# EAGLE design working (EAGLE 9.5.1)
COMPANY: ADAFRUIT INDUSTRIES; DRAWN: LADYADA; REV: D; YEAR: 2020
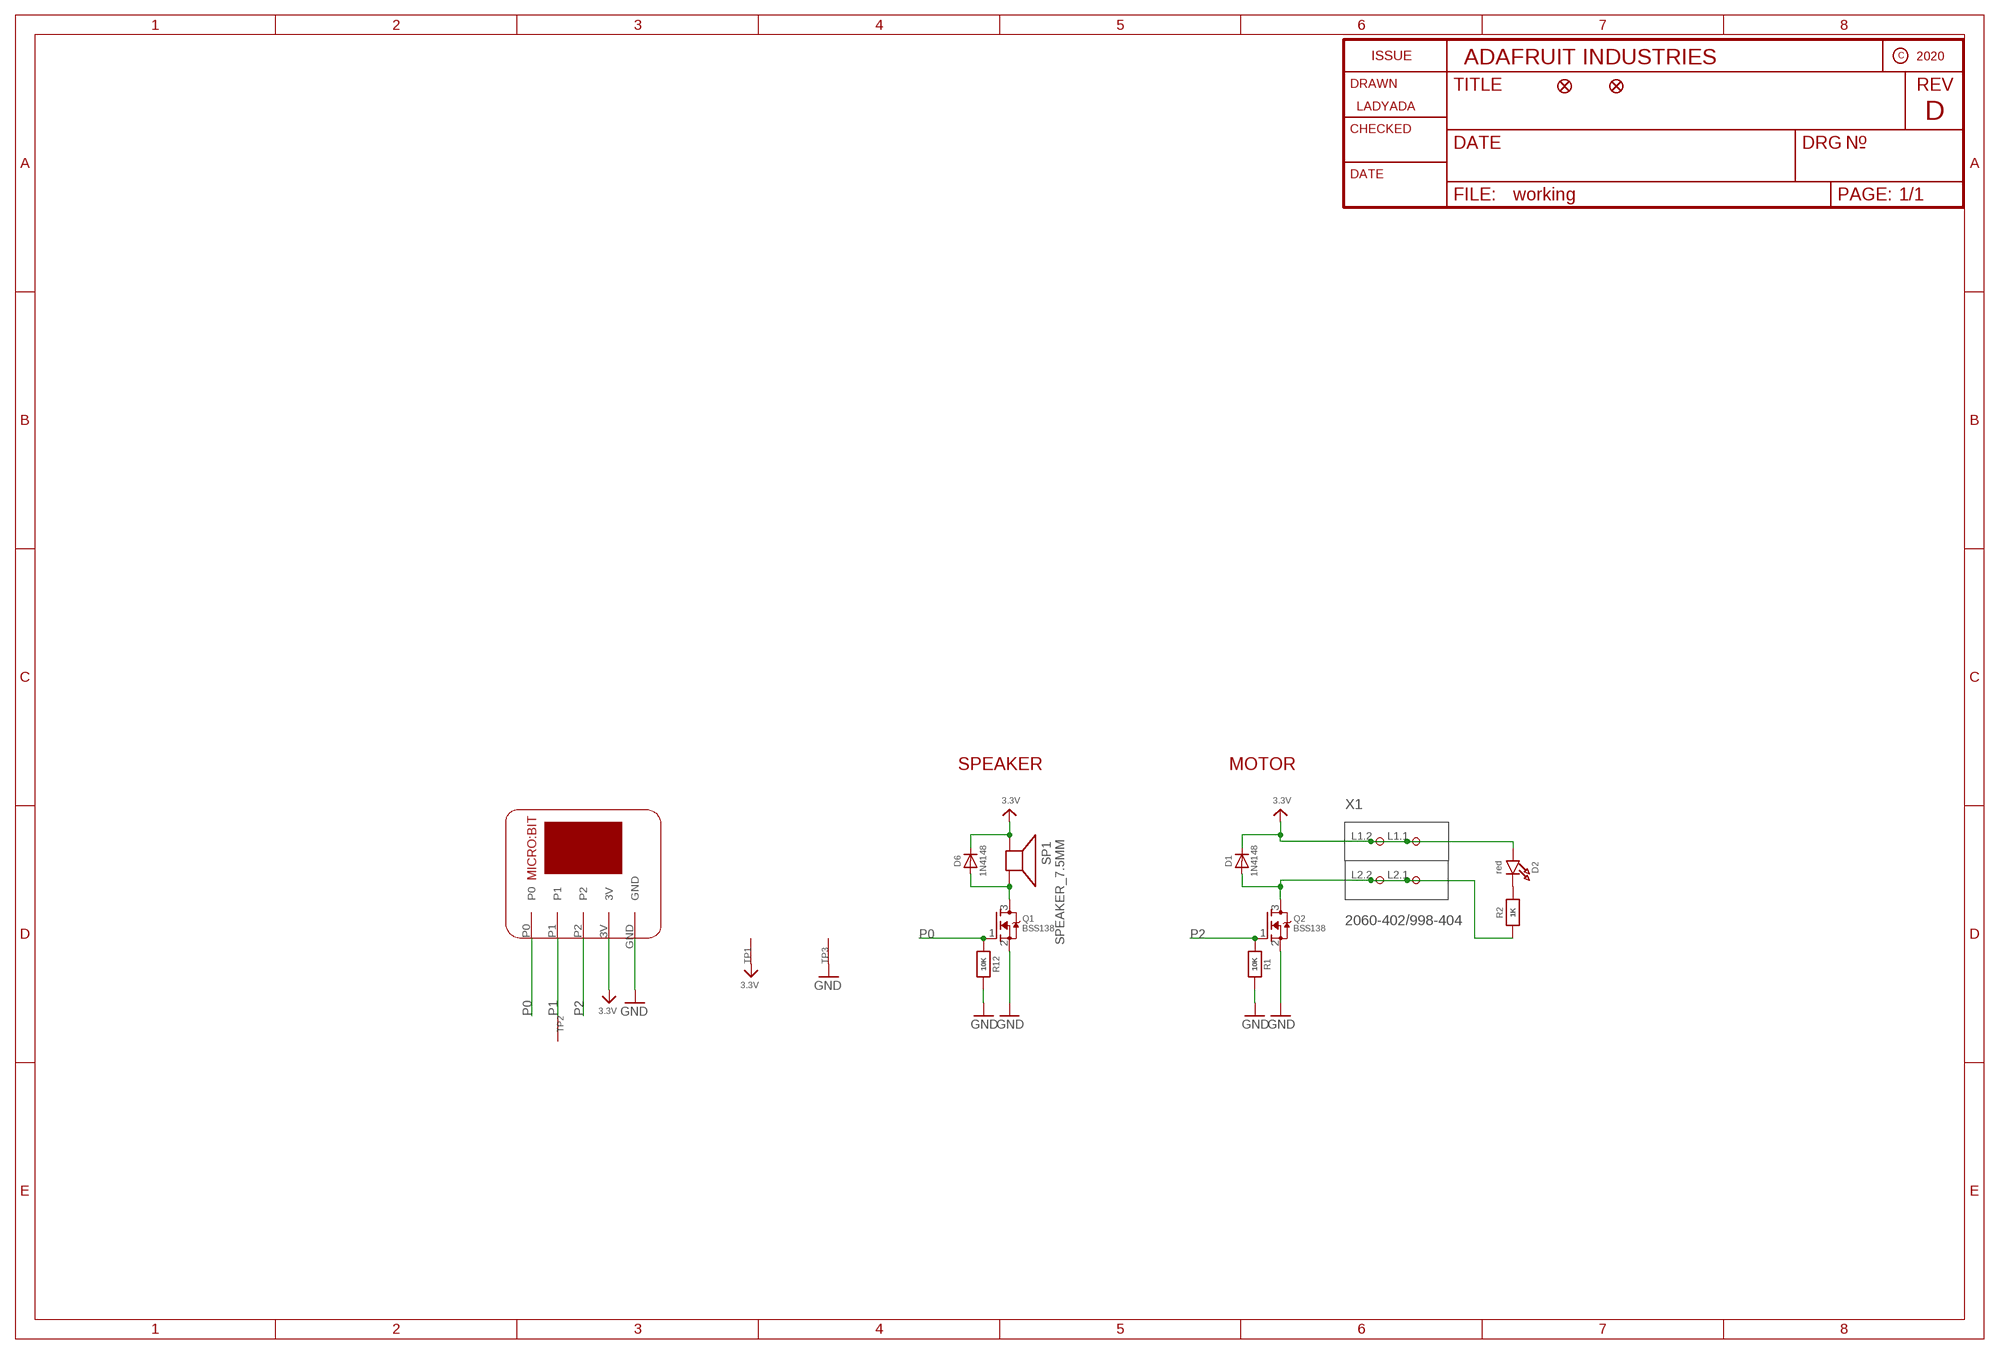
[diagram p0: schematic, sheet 1]

## Parts
D1  1N4148  DIODESOD-323  [SOD-323]
D2  red  LED0805_NOOUTLINE  [CHIPLED_0805_NOOUTLINE]
D6  1N4148  DIODESOD-323  [SOD-323]
FID1  FIDUCIAL_1MM  [FIDUCIAL_1MM]
FID2  FIDUCIAL_1MM  [FIDUCIAL_1MM]
MB2  MICROBIT_5PIN  [MICROBIT_5SMTNUT]
Q1  BSS138  MOSFET-NWIDE  [SOT23-WIDE]
Q2  BSS138  MOSFET-NWIDE  [SOT23-WIDE]
R1  10K  RESISTOR_0603_NOOUT  [0603-NO]
R2  1K  RESISTOR_0603_NOOUT  [0603-NO]
R12  10K  RESISTOR_0603_NOOUT  [0603-NO]
SP1  SPEAKER_7.5MM  [BUZZER_SMT_7.5MM]
TP1  SEWTAPPCB_ALLIGATOR  [PCB_ALLI]
TP2  SEWTAPPCB_ALLIGATOR  [PCB_ALLI]
TP3  SEWTAPPCB_ALLIGATOR  [PCB_ALLI]
X1  2060-402/998-404  [P-2060-402/998-404]

## Nets
3.3V [power]: D1.C D2.A D6.C MB2.3V SP1.+ TP1.P$1(SEW) X1.L1.1(P1.1) X1.L1.2(P1.2)
GND: MB2.GND Q1.2(S) Q2.2(S) R1.2 R12.2 TP3.P$1(SEW)
N$1 [power]: D1.A Q2.3(D) R2.1 X1.L2.1(P2.1) X1.L2.2(P2.2)
N$2: D2.C R2.2
N$4: D6.A Q1.3(D) SP1.-
P0: MB2.P0 Q1.1(G) R12.1
P1: MB2.P1 TP2.P$1(SEW)
P2: MB2.P2 Q2.1(G) R1.1

## Notes on the sheet
- SPEAKER | MOTOR

## Library data of the parts
D1 D6 = microbuilder:DIODE: Diode SMA Model Volts Amps Type Vf Ir Digikey # Notes SSA34-E3 40V 3A Schottky 480mV @ 3A 200uA @ 40V SSA34-E3/61TGITR-ND CDBA120-G 20V 1A Schottky 500mV @ 1A 500uA @ 20V 641-1014-6-ND REEL MBRA210 10V 2A Schottky 350mV @ 2A 700uA @ 10V MBRA210LT3 SOD-123 Model Volts Amps Type Vf Ir Order # Notes BAT54T1G 30V 200mA Schottky 800mV @ 200mA 2uA @ 25V BAT54T1GOSTR-ND B0530W 30V 500mA Schottky 430mV @ 500mA 130uA @ 30V B0530W-FDICT-ND REEL MBR120 20V 1A Schottky 340mV @ 1A MBR120VLSFT1GOSCT-ND SOD-323 Model Volts Amps Type Vf Ir Order # Notes PMEG2005EJ 20V 500mA Schottky 355mV @ 500mA 568-4110-1-ND ZLLS410 10V 570mA Schottky 380mV @ 570mA ZLLS410CT-ND 1N4148WS 75V 150mA Silicon/Simple 1V 1N4148WSFSCT-ND REEL SOD-523 Model Volts Amps Type Vf Ir Order # Notes BAT54XV2 30V 200mA Schottky 0.8V @ 100mA BAT54XV2CT-ND TB751S 30V 30mA Schottky RB751S-40TE61CT-ND SOT23-R/W (R = Solder Paste/Reflow Ovens, W = Hand-Soldering) Model Volts Amps Type Vf Ir Order # Notes BAT54FILM 40V 300mA Schottky 497-7162-1-ND POWERDI-5 Model Volts Amps Type Vf Ir Order # Notes PDS560 60V 5A Schottky 670mV @ 5A 150uA @ 60V PDS560DICT-ND
D2 = microbuilder:LED: LED 0603 - 0603 Surface Mount Package 2mA: Green LED - Low Power (3.9mcd, 2ma, 1.7Vf) - Digikey: 475-2709-2-ND Orange LED - Low Power (9.8mcd, 2ma, 1.8Vf) - Digikey: 475-1194-2-ND Red LED - Low Power (5mcd, 2ma, 1.8Vf) - Digikey: 475-1195-2-ND Yellow LED - Low Power (7mcd, 2ma, 1.8Vf) - Digikey: 475-1196-2-ND 5mA: Blue LED - Low Power (17mcd, 5ma, 2.9Vf) - Digikey: LNJ937W8CRACT-ND 0805 - 0805 Surface Mount Package 2mA: Red LED (8.8mcd, 2mA, 1.8Vf, Clear) - Low Power [Digikey: 475-2510-1-ND] Green LED (5mcd, 2mA, 1.8Vf, Clear) - Low Power [Digikey: 475-2730-1-ND] Yellow LED (11.3mcd, 2mA, 1.8Vf, Clear) - Low Power [Digikey: 475-2555-1-ND] 20mA: Red LED (104mcd, 20mA, Diffused) - LS R976 [Digikey: 475-1278-6-ND] Red LED (12mcd, 20mA, 2.0Vf, Clear) - APT2012EC [Digikey: 754-1128-1-ND] Green LED (15mcd, 20mA, 2.2Vf, Clear) - APT2012GC [Digikey: 754-1131-1-ND] Orange LED (160mcd, 20mA, 2.1Vf, Clear) - APT2012SECK [Digikey: 754-1130-1-ND] 1206 - 1206 Surface Mount Package Green LED (26mcd, 20mA, Diffused) - LG N971 [Digikey: 475-1407-6-ND] Red LED (15mcd, 20mA, Diffused) - LH N974 [Digikey: 475-1416-6-ND] Cree - Cree High-Power Surface Mount LEDs XPEBWT-L1-0000-00D50 - White 111lm 350mA 2.9Vf 6200K 110° XTEAWT-00-0000-00000LEE3 - White 114lm 350mA 2.85Vf 5000K 115° Everlight - Everlight 45-21 Series Surface Mount LEDs 45-21/QK2C-B2832AC2CB2/2T - Warm White 2000mcd 20mA 3.25Vf 3050K 120° 45-21/LK2C-B38452C4CB2/2T - Nuetral White 2000mcd 20mA 3.25Vf 4150K 120° 45-21/LK2C-B50634C6CB2/2T - Cold White 2200mcd 20mA 3.25Vf 5650K 120° PLCC2 Reverse Mount LS T77K-J1L2-1-0-2-R18-Z - Red 11.25mcd 2mA 1.8Vf 630nm 120° LO T77K-L1M2-24-Z - Orange 19.6mcd 2mA 1.8Vf 606nm 120° LY T77K-K2M1-26-Z - Yellow 15.7mcd 2mA 1.8Vf 587nm 120°
FID1 FID2 = microbuilder:FIDUCIAL: Fiducial Alignment Points Various fiducial points for machine vision alignment.; BOM: EXCLUDE
MB2 = adafruit_connector:MICROBIT_5PIN
Q1 Q2 = microbuilder:MOSFET-N: N-Channel Mosfet LEGEND VDS: Voltage Drain-Source ID: Drain Current RDS(ON): Drain-Source On-State Resistance VGS(TH): Gate-Source Threshold Voltage CISS: Drain-Source Input Capacitance SOT-23 Name VDS ID RDS(ON) VGS(TH) CISS Order Number 2N7002E 60V 260mA 2.5 Ohm 2.5V @ 250uA 26.7pF @ 25V 2N7002ET1GOSTR-ND BSH103 30V 850mA 400 mOhm 400mV @ 1mA 83pF @ 24V BSH103,235-ND BSS138 60V 320mA 1.6 Ohm 1.5V @ 250uA 50pF @ 10V Mouser: 771-BSS138PW115 DMN2075U-7 20V 4.2A 38 mOhm 1V @ 250 uA 594.3pF @ 10V DMN2075U-7DICT-ND * BSS138 good choice for I2C level-shifting POWERPAK 1212-8 Name VDS ID RDS(ON) VGS(TH) CISS Order Number Si7308DN 60V 6A 58 mOhm 3V @ 250uA 665pF @ 15V SI7308DN-T1-E3CT-ND
R1 R2 R12 = microbuilder:RESISTOR: Resistors For new designs, use the packages preceded by an '_' character since they are more reliable: The following footprints should be used on most boards: _0402 - Standard footprint for regular board layouts _0603 - Standard footprint for regular board layouts _0805 - Standard footprint for regular board layouts _1206 - Standard footprint for regular board layouts For extremely tight-pitch boards where space is at a premium, the following 'micro-pitch' footprints can be used (smaller pads, no silkscreen outline, etc.): _0402MP - Micro-pitch footprint for very dense/compact boards _0603MP - Micro-pitch footprint for very dense/compact boards _0805MP - Micro-pitch footprint for very dense/compact boards _1206MP - Micro-pitch footprint for very dense/compact boards
SP1 = microbuilder:SPEAKER: SPEAKER Source: Buerklin Added PS12 (for part # PS1240 piezo) http://www.ladyada.net/library/pcb/eaglelibrary.html
TP1-TP3 = microbuilder:SEWTAP
X1 = adafruit_connector:2060-402/998-404: Serie 2060, SMD-Leiterplattenklemme mit Betätigungsdrückern im Gurt 2-polig / Series 2060, SMD terminal block with push-buttons in tape-and-reel packing 2-pole Polzahl / Pole No.: 2 Rastermaß / Pitch: 4 mm Bemessungsspannung / Rated Voltage: 160 V Nennstrom / Nominal Current: 9 A Leiterquerschnitt / Conductor Size: 0.2 - 0.75 mm2 Anschlusstechnik / Connection Technology: CAGE CLAMP® S Leitereinführung (zur Platine) / Conductor entry angle (to PCB): 0 ° Farbe / Color: lichtgrau / light gray Stand: 01.01.2014. Die jeweils aktuellen Daten zu diesem Artikel finden Sie in unserem Produktkatalog, den Sie unter www.wago.com einsehen können. As of: 01/01/2014. Please find the newest data for this article in our product catalogue, which can be viewed under www.wago.com.

## Net classes
1 power: width 0.254 mm
2 lowpower: width 0.305 mm, drill 0.483 mm

## Board
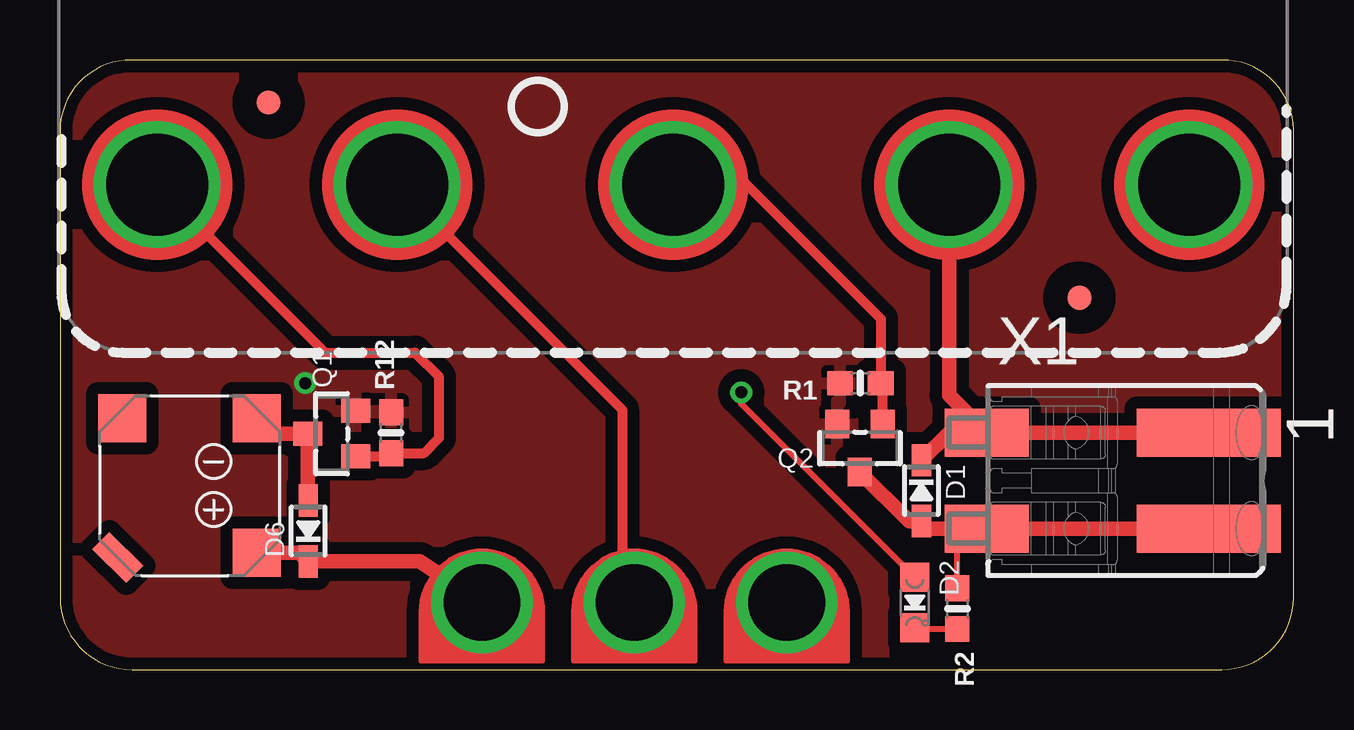
[diagram p1: board, top side]
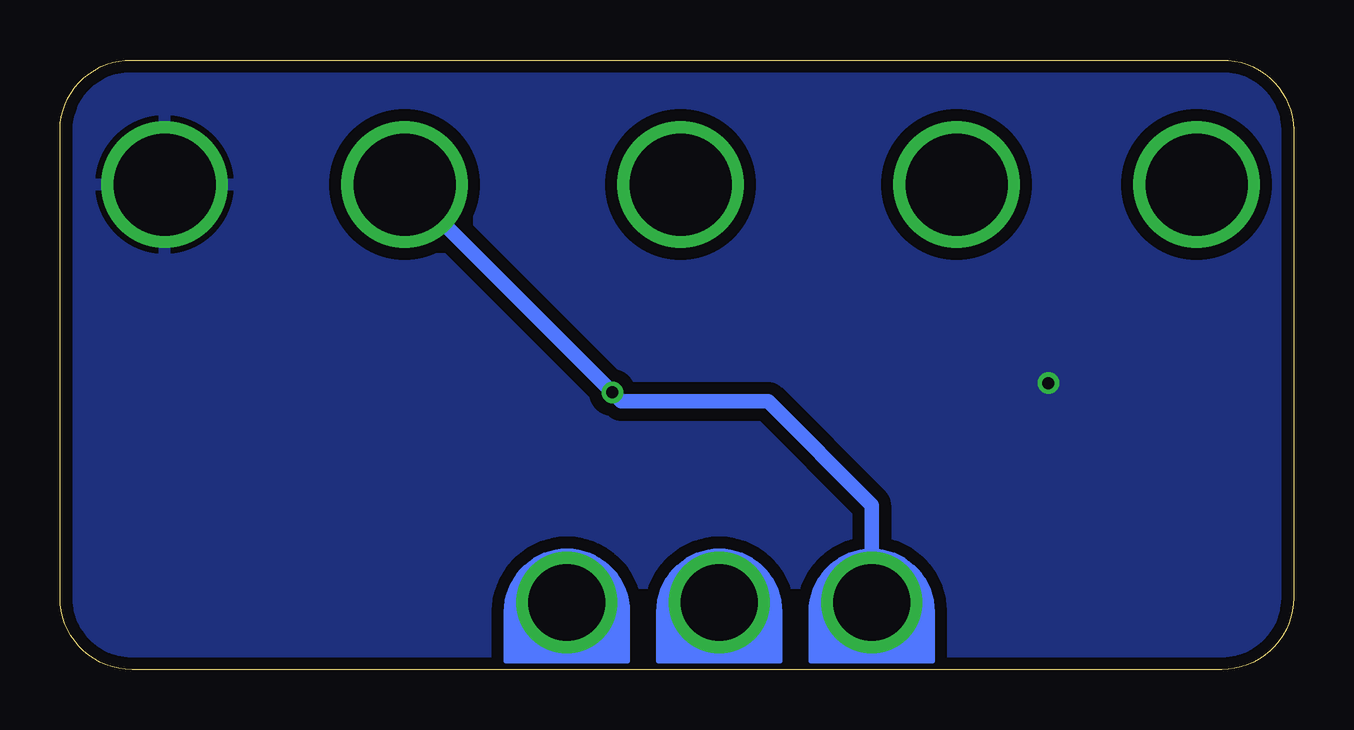
[diagram p2: board, bottom side, seen from below]

Size 51.4 x 25.4 mm. Coordinates in mm from the lower left corner, seen from the top.
Outline: 48.4,25.4 3,25.4 arc90 0,22.49 0,3 arc90 3,0 48.4,0 arc90 51.4,3 51.4,22.49 arc90 48.4,25.4
Copper layers (1*16): Top 0.035mm / dielectric 1.5mm / Bottom 0.035mm
Design rules "adafruit 88": minimum track width 8mil, minimum drill 15.5mil, track to track 8mil, track to pad 8mil, pad to pad 8mil, via to via 8mil, smd to smd 8mil, copper to edge 10mil, drill to drill 8mil, minimum pad ring 10mil, minimum via ring 8mil, stop-mask expansion 2mil, vias tented up to drill 20mil, thermal gap 10mil

### Footprints (pad centres in the part's own frame; a part is rotated, then mirrored left to right if it is on the bottom)
SOD-323 = smd 1.35 x 0.8: A 1.27,0; C -1.27,0
CHIPLED_0805_NOOUTLINE = smd 1.2 x 1.2: A 0,-1.05; C 0,1.05
FIDUCIAL_1MM = smd 1 x 1: 1 0,0
MICROBIT_5SMTNUT = drill 4.25 pad 4.572: 3V 11.5,7; GND 21.5,7; P0 -21.5,7; P1 -11.5,7; P2 0,7
SOT23-WIDE = smd 1 x 1.2: 1 -0.95,-1; 2 0.95,-1; 3 0,1
0603-NO = smd 1.075 x 1: 1 -0.85,0; 2 0.85,0
BUZZER_SMT_7.5MM = smd 2 x 2: + 2.8,-2.8; - 2.8,2.8; MT2 -2.8,2.8 | smd 2 x 1 rotated 135: MT -3,-3
PCB_ALLI = drill 3.2: P$1 0,0.508
P-2060-402/998-404 = smd 6 x 2: L1.1 4.625,2; L2.1 4.625,-2 | smd 3.5 x 2: L1.2 -4.625,2; L2.2 -4.625,-2

### Placement (x,y rotation side)
D1  35.89,7.45 270 top
D2  35.61,2.79 180 top
D6  10.34,5.78 90 top
FID1  8.69,23.62 0 top
FID2  42.47,15.49 0 top
MB2  25.54,13.21 0 top
Q1  11.32,9.83 90 top
Q2  33.33,9.23 180 top
R1  33.35,11.94 180 top
R2  37.39,2.54 270 top
R12  13.8,9.87 90 top
SP1  5.4,7.67 0 top
TP1  17.58,3.3 180 top
TP2  23.93,3.3 180 top
TP3  30.28,3.3 180 top
U$4  [BONSAI_BOT]  51.36,0 0 bottom
U$5  [BONSAI_TOP]  -0.2,0 0 top
U$10  [PCBFEAT-REV-056]  19.9,23.46 0 top
X1  43.23,7.87 0 top

### Tracks (layer width: path | path; a pad name or v marks a point on that pad's centre or on a via)
3.3V  (via drill 0.5)
  Top 0.254: D2.A 28.38,11.07 v28.38,11.55
  Top 0.61: SP1.+ 9.98,4.87 D6.C 14.98,4.51 TP1.P$1 | X1.L1.1 X1.L1.2 | MB2.3V 37.04,11.44 X1.L1.2 | D1.C 37.04,9.87 X1.L1.2
  Bottom 0.61: MB2.3V v28.38,11.55 28.01,11.18 21.9,11.18 17.58,6.86 TP1.P$1
GND  (via drill 0.5)
  other vias: 10.21,11.94
  pour Top (isolate 0.508): 0.05,25.4 51.36,25.4 51.36,0 0.05,0
  pour Bottom (isolate 0.508): 0.05,25.4 51.36,25.4 51.36,0 0.05,0
N$1
  Top 0.254: R2.1 37.39,5.62 37.65,5.87
  Top 0.61: Q2.3 35.38,6.18 D1.A 36.2,5.87 37.65,5.87 X1.L2.2 X1.L2.1
N$2
  Top 0.254: R2.2 35.67,1.69 D2.C
N$4
  Top 0.61: SP1.- 8.84,9.83 Q1.3 10.32,7.07 D6.A
P0
  Top 0.406: Q1.1 13.66,8.88 R12.1 15.17,9.02 15.8,9.65 15.8,12.19 14.79,13.21 11.04,13.21 MB2.P0
P1
  Top 0.406: TP2.P$1 23.42,2.29 23.42,10.83 MB2.P1
P2
  Top 0.406: Q2.1 34.28,11.85 R1.1 34.2,14.62 28.61,20.21 MB2.P2